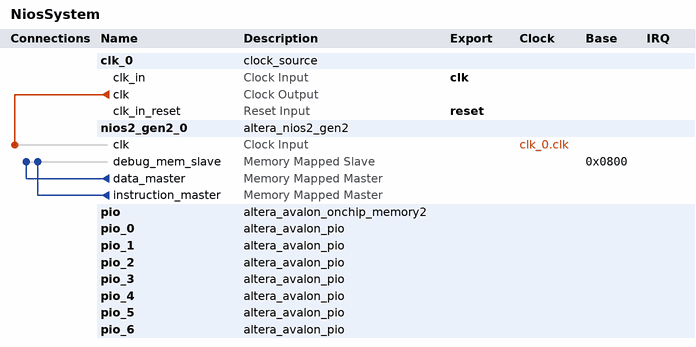
[diagram p0: system contents]
# Platform Designer (Qsys) system NiosSystem, MAX 10 10M50DAF484C7G
# Parameters at their usual value, and those the tool derives, are not listed.
package require -exact qsys 18.1
create_system NiosSystem
set_project_property DEVICE_FAMILY {MAX 10}
set_project_property DEVICE 10M50DAF484C7G

add_instance clk_0 clock_source 18.1
set_instance_parameter_value clk_0 clockFrequency 50000000

add_instance nios2_gen2_0 altera_nios2_gen2 18.1
set_instance_parameter_value nios2_gen2_0 dcache_size 2048
set_instance_parameter_value nios2_gen2_0 exceptionSlave None
set_instance_parameter_value nios2_gen2_0 icache_size 4096
set_instance_parameter_value nios2_gen2_0 impl Fast
set_instance_parameter_value nios2_gen2_0 resetSlave None

add_instance pio altera_avalon_onchip_memory2 18.1
set_instance_parameter_value pio dataWidth 32
set_instance_parameter_value pio dualPort false
set_instance_parameter_value pio initMemContent true
set_instance_parameter_value pio initializationFileName onchip_mem.hex
set_instance_parameter_value pio memorySize 100000

add_instance pio_0 altera_avalon_pio 18.1
set_instance_parameter_value pio_0 direction Output
set_instance_parameter_value pio_0 width 10

add_instance pio_1 altera_avalon_pio 18.1
set_instance_parameter_value pio_1 direction Input
set_instance_parameter_value pio_1 width 10

add_instance pio_2 altera_avalon_pio 18.1
set_instance_parameter_value pio_2 direction Input
set_instance_parameter_value pio_2 width 2

add_instance pio_3 altera_avalon_pio 18.1
set_instance_parameter_value pio_3 direction Output
set_instance_parameter_value pio_3 width 24

add_instance pio_4 altera_avalon_pio 18.1
set_instance_parameter_value pio_4 direction Output
set_instance_parameter_value pio_4 width 24

add_instance pio_5 altera_avalon_pio 18.1
set_instance_parameter_value pio_5 direction Output
set_instance_parameter_value pio_5 width 4

add_instance pio_6 altera_avalon_pio 18.1
set_instance_parameter_value pio_6 direction Input
set_instance_parameter_value pio_6 width 1

# connections
add_connection clk_0.clk nios2_gen2_0.clk clock
add_connection nios2_gen2_0.data_master nios2_gen2_0.debug_mem_slave avalon
set_connection_parameter_value nios2_gen2_0.data_master/nios2_gen2_0.debug_mem_slave baseAddress 0x0800
add_connection nios2_gen2_0.instruction_master nios2_gen2_0.debug_mem_slave avalon
set_connection_parameter_value nios2_gen2_0.instruction_master/nios2_gen2_0.debug_mem_slave baseAddress 0x0800

# exported interfaces
add_interface clk clock sink
set_interface_property clk EXPORT_OF clk_0.clk_in
add_interface reset reset sink
set_interface_property reset EXPORT_OF clk_0.clk_in_reset

set_interconnect_requirement {$system} qsys_mm.clockCrossingAdapter HANDSHAKE
set_interconnect_requirement {$system} qsys_mm.enableEccProtection FALSE
set_interconnect_requirement {$system} qsys_mm.insertDefaultSlave FALSE
set_interconnect_requirement {$system} qsys_mm.maxAdditionalLatency 1

save_system NiosSystem.qsys
